# Altium schematic sheet DSO_ADC.SchDoc: Schematic_Name
size A4; CompanyName: University of Melbourne; Engineer: Your Name Here; DocumentNumber: 1; Revision: 0.1; SheetNumber: 1; SheetTotal: 1; Title_Project: Project_Title; StudentNo: Student No.
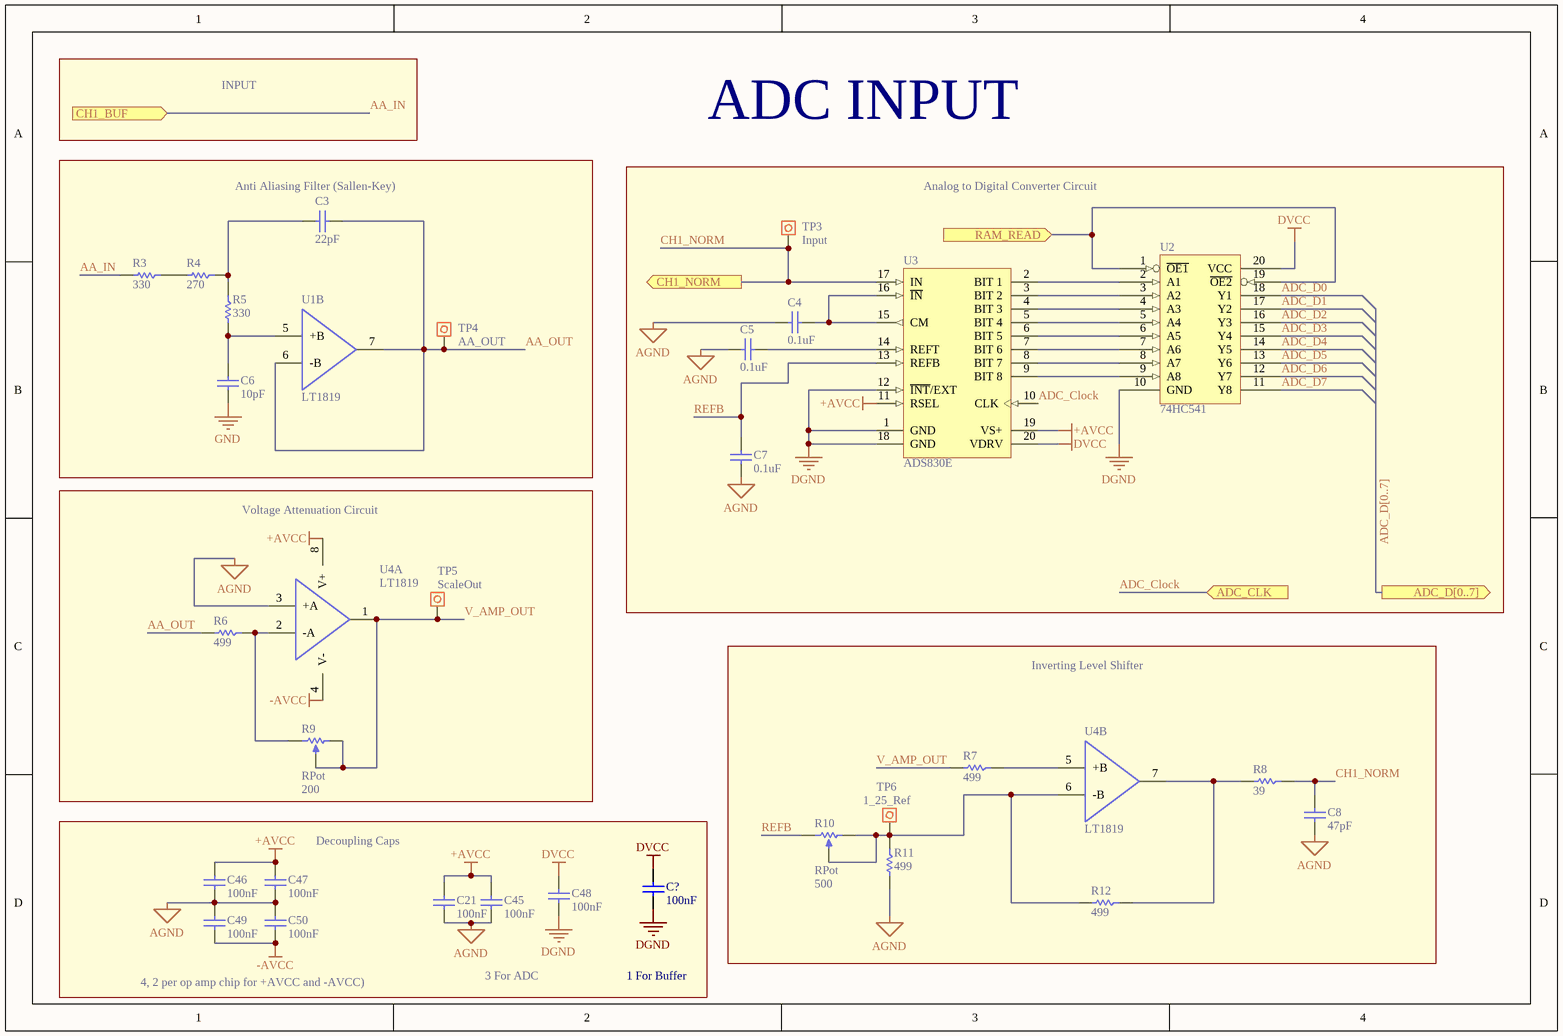
[diagram p0: DSO_ADC.SchDoc]

## Parts
C3  22pF  [0805C]
C4  0.1uF  [0805C]
C5  0.1uF  [0805C]
C6  10pF  [0805C]
C7  0.1uF  [0805C]
C8  47pF  [0805C]
C21  100nF  [0805C]
C45  100nF  [0805C]
C46  100nF  [0805C]
C47  100nF  [0805C]
C48  100nF  [0805C]
C49  100nF  [0805C]
C50  100nF  [0805C]
C?  100nF  [0805C]
R3  330  [0805]
R4  270  [0805]
R5  330  [0805]
R6  499  [0805]
R7  499  [0805]
R8  39  [0805]
R9  RPot  value 200  [VR5]
R10  RPot  value 500  [VR5]
R11  499  [0805]
R12  499  [0805]
TP3  INPUT  [Testpoin]
TP4  value AA_OUT  [Testpoin]  (hidden comment: INPUT)
TP5  value ScaleOut  [Testpoin]  (hidden comment: INPUT)
TP6  value 1_25_Ref  [Testpoin]  (hidden comment: INPUT)
U1  LT1819  [SOIC-8]  (part B of 2)
U2  74HC541  [SOT163-1_N]
U3  ADS830E  [TI-DBQ20_L]
U4  LT1819  [SOIC-8]  (parts A,B of 2)

## Blocks framed on the sheet
Anti Aliasing Filter (Sallen-Key): C3 C6 R3-R5 TP4 U1
Analog to Digital Converter Circuit: C4 C5 C7 TP3 U2 U3
Voltage Attenuation Circuit: R6 R9 TP5 U4
Inverting Level Shifter: C8 R7 R8 R10-R12 TP6 U4

## Ports
ADC_CLK (in), ADC_D[0..7] (out), CH1_BUF (in), CH1_NORM (out), RAM_READ (in)

## Nets
+AVCC: C21.1 C45.1 C46.1 C47.1 U3.11(RSEL) U3.19(VS+) U4.8(V+)
-AVCC: C49.1 C50.1 U4.4(V-)
AGND: C4.1 C5.1 C7.1 C8.2 C21.2 C45.2 C46.2 C47.2 C49.2 C50.2 R11.2 U4.3(+A)
DGND: C48.2 C?.2 U2.10(GND) U3.1(GND) U3.12(~{INT}/EXT) U3.18(GND)
DVCC: C48.1 C?.1 U2.20(VCC) U3.20(VDRV)
GND: C6.2
AA_IN: R3.2 ; port CH1_BUF
AA_OUT: C3.1 R6.2 TP4.1 U1.6(-B) U1.7(OUTB)
ADC_Clock: U3.10(CLK) ; port ADC_CLK
ADC_D0: U2.18(Y1)
ADC_D1: U2.17(Y2)
ADC_D2: U2.16(Y3)
ADC_D3: U2.15(Y4)
ADC_D4: U2.14(Y5)
ADC_D5: U2.13(Y6)
ADC_D6: U2.12(Y7)
ADC_D7: U2.11(Y8)
CH1_NORM: C8.1 R8.1 TP3.1 U3.17(IN) ; port CH1_NORM
RAM_READ: U2.1(~{OE1}) U2.19(~{OE2}) ; port RAM_READ
REFB: C7.2 R10.1(TOP) U3.13(REFB)
V_AMP_OUT: R7.2 R9.2(TAP) R9.3(BOT) TP5.1 U4.1(OUTA)
NetC3_2: C3.2 R4.1 R5.1
NetC4_2: C4.2 U3.15(CM) U3.16(~{IN})
NetC5_2: C5.2 U3.14(REFT)
NetC6_1: C6.1 R5.2 U1.5(+B)
NetR3_1: R3.1 R4.2
NetR6_1: R6.1 R9.1(TOP) U4.2(-A)
NetR7_1: R7.1 U4.5(+B)
NetR8_2: R8.2 R12.1 U4.7(OUTB)
NetR10_2: R10.2(TAP) R10.3(BOT) R11.1 R12.2 TP6.1 U4.6(-B)
NetU2_2: U2.2(A1) U3.2(BIT_1)
NetU2_3: U2.3(A2) U3.3(BIT_2)
NetU2_4: U2.4(A3) U3.4(BIT_3)
NetU2_5: U2.5(A4) U3.5(BIT_4)
NetU2_6: U2.6(A5) U3.6(BIT_5)
NetU2_7: U2.7(A6) U3.7(BIT_6)
NetU2_8: U2.8(A7) U3.8(BIT_7)
NetU2_9: U2.9(A8) U3.9(BIT_8)

## Buses and harness runs
bus ADC_D[0..7] = port ADC_D[0..7]

## Notes on the sheet
- INPUT
- ADC INPUT
- Decoupling Caps
- 4, 2 per op amp chip for +AVCC and -AVCC)
- 3 For ADC
- 1 For Buffer

## Library data of the parts
C3-C8 C21 C45-C50 C? = C: Capacitor; Reviewed by: RM - 2018/08/05; Revision: July-2002: Re-released for DXP Platform.; Supplier 1: *; Supplier Part Number 1: *
  C3: Value: 22pF
  C4 C5 C7: Value: 0.1uF
  C6: Value: 10pF
  C8: Value: 47pF
  C21 C45-C50 C?: Value: 100nF
R3-R8 R11 R12 = R: Resistor; Reviewed by: RM - 2018/08/05; Supplier 1: *; Suppler Part Number 1: *
  R3 R5: Value: 330
  R4: Value: 270
  R6 R7 R11 R12: Value: 499
  R8: Value: 39
R9 R10 = RPot: Potentiometer; Sim Note: Enter the Resistance value and the set point into parameter fields.; Set Position: 0.5; Published: 8-Jun-2000; LatestRevisionDate: 17-Jul-2002; LatestRevisionNote: Re-released for DXP Platform.; PackageReference: VR5; Publisher: Altium Limited; PackageDescription: Variable Resistor, Thru-Hole; 3 Leads
TP3-TP6 = Test Point: Pad
  TP3: Value: Input
U1 U4 = LT1819: OpAmp High Frequency Dual; Reviewed by: RM - 2018/08/05; Supplier 1: Digi-Key; Supplier Part Number 1: LT1819CMS8#PBF-ND
U2 = 74HC541: (ADV) Octal Buffer, Line Driver; Reviewed by: RM - 2018/08/05; Supplier 1: Digi-Key; Supplier Part Number 1: 296-1202-1-ND
U3 = ADS830E: 8-Bit, 60 MSPS ADC Single-Ended / Differential Input, Internal / External Reference and Programmble Input Range, -40 to 85 degC, 20-pin SOP (DBQ20), Green (RoHS & no Sb/Br); Reviewed by: RM - 2018/08/05; ComponentLink2URL: http://www.ti.com/general/docs/lit/getliterature.tsp?genericPartNumber=ADS830&fileType=pdf; ComponentLink2Description: Datasheet; ComponentLink1URL: http://www.ti.com/; ComponentLink3URL: http://www.ti.com/litv/pdf/mpds210a; ComponentLink3Description: Package Specification; ComponentLink1Description: Manufacturer URL; Supplier 1: Digi-Key; Supplier Part Number 1: ADS830E-ND